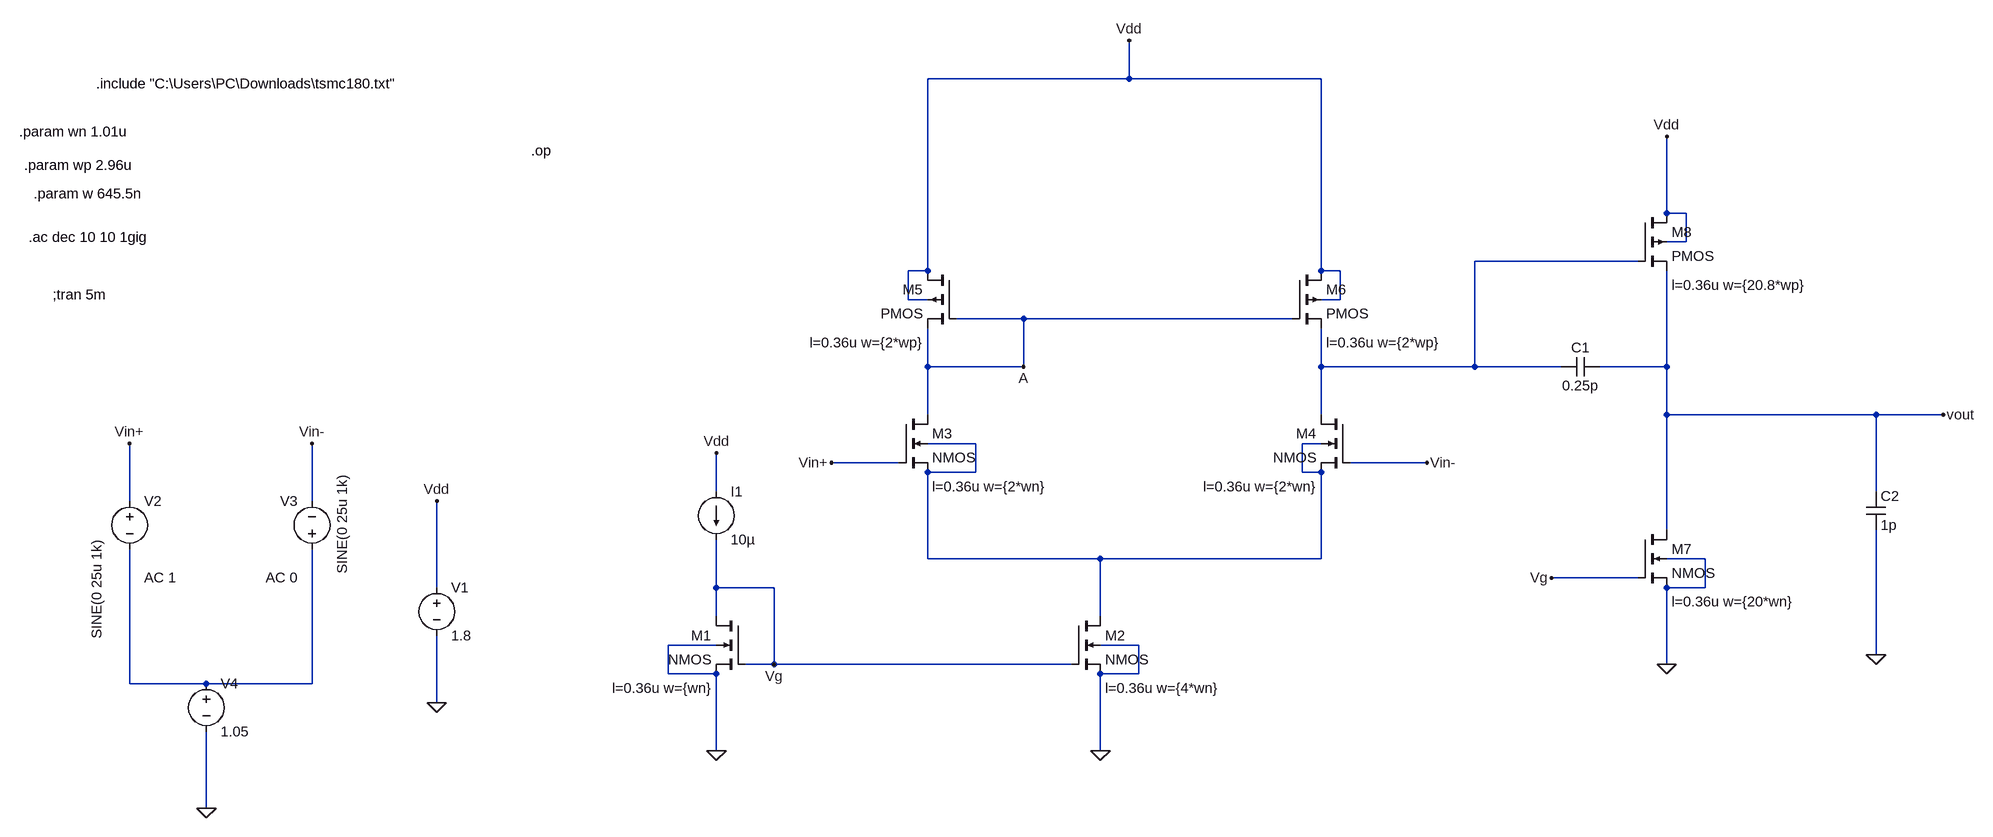
[diagram p0: schematic miller_2stage.asc]
miller_2stage.asc, the LTspice schematic file:
Version 4
SHEET 1 2980 1012
WIRE 1552 -864 1552 -928
WIRE 1552 -864 1216 -864
WIRE 1872 -864 1552 -864
WIRE 2448 -640 2448 -768
WIRE 2480 -640 2448 -640
WIRE 2480 -592 2480 -640
WIRE 2480 -592 2448 -592
WIRE 2400 -560 2128 -560
WIRE 1216 -544 1216 -864
WIRE 1216 -544 1184 -544
WIRE 1872 -544 1872 -864
WIRE 1904 -544 1872 -544
WIRE 1184 -496 1184 -544
WIRE 1216 -496 1184 -496
WIRE 1904 -496 1904 -544
WIRE 1904 -496 1872 -496
WIRE 1376 -464 1264 -464
WIRE 1824 -464 1376 -464
WIRE 1216 -384 1216 -448
WIRE 1376 -384 1376 -464
WIRE 1376 -384 1216 -384
WIRE 1872 -384 1872 -448
WIRE 2128 -384 2128 -560
WIRE 2128 -384 1872 -384
WIRE 2272 -384 2128 -384
WIRE 2448 -384 2448 -544
WIRE 2448 -384 2336 -384
WIRE 1216 -304 1216 -384
WIRE 1872 -304 1872 -384
WIRE 2448 -304 2448 -384
WIRE 2800 -304 2448 -304
WIRE 2912 -304 2800 -304
WIRE 1296 -256 1216 -256
WIRE 1872 -256 1840 -256
WIRE 1168 -224 1056 -224
WIRE 2048 -224 1920 -224
WIRE 1296 -208 1296 -256
WIRE 1296 -208 1216 -208
WIRE 1840 -208 1840 -256
WIRE 1872 -208 1840 -208
WIRE 864 -176 864 -240
WIRE 2800 -176 2800 -304
WIRE -544 -160 -544 -256
WIRE -240 -160 -240 -256
WIRE 2448 -112 2448 -304
WIRE 1216 -64 1216 -208
WIRE 1504 -64 1216 -64
WIRE 1872 -64 1872 -208
WIRE 1872 -64 1504 -64
WIRE 2512 -64 2448 -64
WIRE 2400 -32 2256 -32
WIRE -32 -16 -32 -160
WIRE 864 -16 864 -96
WIRE 960 -16 864 -16
WIRE 2512 -16 2512 -64
WIRE 2512 -16 2448 -16
WIRE 864 32 864 -16
WIRE 1504 32 1504 -64
WIRE 864 80 784 80
WIRE 1568 80 1504 80
WIRE 2800 96 2800 -112
WIRE 960 112 960 -16
WIRE 960 112 912 112
WIRE 1456 112 960 112
WIRE 2448 112 2448 -16
WIRE 784 128 784 80
WIRE 864 128 784 128
WIRE 1568 128 1568 80
WIRE 1568 128 1504 128
WIRE -544 144 -544 -80
WIRE -416 144 -544 144
WIRE -240 144 -240 -80
WIRE -240 144 -416 144
WIRE -32 176 -32 64
WIRE 864 256 864 128
WIRE 1504 256 1504 128
WIRE -416 352 -416 224
FLAG 864 -240 Vdd
FLAG 960 112 Vg
FLAG -32 176 0
FLAG -32 -160 Vdd
FLAG 1056 -224 Vin+
FLAG 2048 -224 Vin-
FLAG 1552 -928 Vdd
FLAG 1376 -384 A
FLAG -416 352 0
FLAG -544 -256 Vin+
FLAG -240 -256 Vin-
FLAG 1504 256 0
FLAG 864 256 0
FLAG 2448 112 0
FLAG 2256 -32 Vg
FLAG 2800 96 0
FLAG 2912 -304 vout
FLAG 2448 -768 Vdd
SYMBOL nmos4 912 32 M0
WINDOW 123 56 120 Left 2
SYMATTR Value2 l=0.36u w={wn}
SYMATTR InstName M1
SYMBOL current 864 -176 R0
WINDOW 123 0 0 Left 0
WINDOW 39 0 0 Left 0
SYMATTR InstName I1
SYMATTR Value 10µ
SYMBOL voltage -32 -32 R0
WINDOW 123 0 0 Left 0
WINDOW 39 0 0 Left 0
SYMATTR InstName V1
SYMATTR Value 1.8
SYMBOL nmos4 1456 32 R0
WINDOW 123 56 120 Left 2
SYMATTR Value2 l=0.36u w={4*wn}
SYMATTR InstName M2
SYMBOL nmos4 1168 -304 R0
WINDOW 123 56 120 Left 2
SYMATTR Value2 l=0.36u w={2*wn}
SYMATTR InstName M3
SYMBOL nmos4 1920 -304 M0
WINDOW 123 56 120 Left 2
SYMATTR Value2 l=0.36u w={2*wn}
SYMATTR InstName M4
SYMBOL pmos4 1264 -544 M0
WINDOW 123 56 120 Left 2
SYMATTR Value2 l=0.36u w={2*wp}
SYMATTR InstName M5
SYMBOL pmos4 1824 -544 R0
WINDOW 123 56 120 Left 2
SYMATTR Value2 l=0.36u w={2*wp}
SYMATTR InstName M6
SYMBOL voltage -544 -176 R0
WINDOW 3 355 -28 VRight 2
WINDOW 123 24 144 Left 2
WINDOW 39 0 0 Left 0
SYMATTR Value SINE(0 25u 1k)
SYMATTR Value2 AC 1
SYMATTR InstName V2
SYMBOL voltage -240 -64 R180
WINDOW 0 24 96 Left 2
WINDOW 3 358 -133 VRight 2
WINDOW 123 24 -32 Left 2
WINDOW 39 0 0 Left 0
SYMATTR InstName V3
SYMATTR Value SINE(0 25u 1k)
SYMATTR Value2 AC 0
SYMBOL voltage -416 128 R0
WINDOW 123 0 0 Left 0
WINDOW 39 0 0 Left 0
SYMATTR InstName V4
SYMATTR Value 1.05
SYMBOL cap 2336 -400 R90
WINDOW 0 0 32 VBottom 2
WINDOW 3 32 32 VTop 2
SYMATTR InstName C1
SYMATTR Value 0.25p
SYMBOL nmos4 2400 -112 R0
WINDOW 123 56 120 Left 2
SYMATTR Value2 l=0.36u w={20*wn}
SYMATTR InstName M7
SYMBOL pmos4 2400 -640 R0
WINDOW 123 56 120 Left 2
SYMATTR Value2 l=0.36u w={20.8*wp}
SYMATTR InstName M8
SYMBOL cap 2784 -176 R0
SYMATTR InstName C2
SYMATTR Value 1p
TEXT -600 -856 Left 2 !.include "C:\\Users\\PC\\Downloads\\tsmc180.txt"
TEXT -728 -776 Left 2 !.param wn 1.01u
TEXT -720 -720 Left 2 !.param wp 2.96u
TEXT -704 -672 Left 2 !.param w 645.5n
TEXT -712 -600 Left 2 !.ac dec 10 10 1gig
TEXT -672 -504 Left 2 !;tran 5m
TEXT 384 -744 Left 2 !.op

The netlist it stands for:
* miller_2stage.asc
M1 Vg Vg 0 0 NMOS l=0.36u w={wn}
I1 Vdd Vg 10µ
V1 Vdd 0 1.8
M2 N002 Vg 0 0 NMOS l=0.36u w={4*wn}
M3 A Vin+ N002 N002 NMOS l=0.36u w={2*wn}
M4 N001 Vin- N002 N002 NMOS l=0.36u w={2*wn}
M5 Vdd A A Vdd PMOS l=0.36u w={2*wp}
M6 Vdd A N001 Vdd PMOS l=0.36u w={2*wp}
V2 Vin+ N003 SINE(0 25u 1k) AC 1
V3 N003 Vin- SINE(0 25u 1k) AC 0
V4 N003 0 1.05
C1 vout N001 0.25p
M7 vout Vg 0 0 NMOS l=0.36u w={20*wn}
M8 Vdd N001 vout Vdd PMOS l=0.36u w={20.8*wp}
C2 vout 0 1p
.model NMOS NMOS
.model PMOS PMOS
.lib standard.mos
.include "C:\Users\PC\Downloads\tsmc180.txt"
.param wn 1.01u
.param wp 2.96u
.param w 645.5n
.ac dec 10 10 1gig
;tran 5m
.op
.backanno
.end